# Altium schematic sheet REF_Diverse.SchDoc
size A4; SheetNumber: 7; SheetTotal: 8
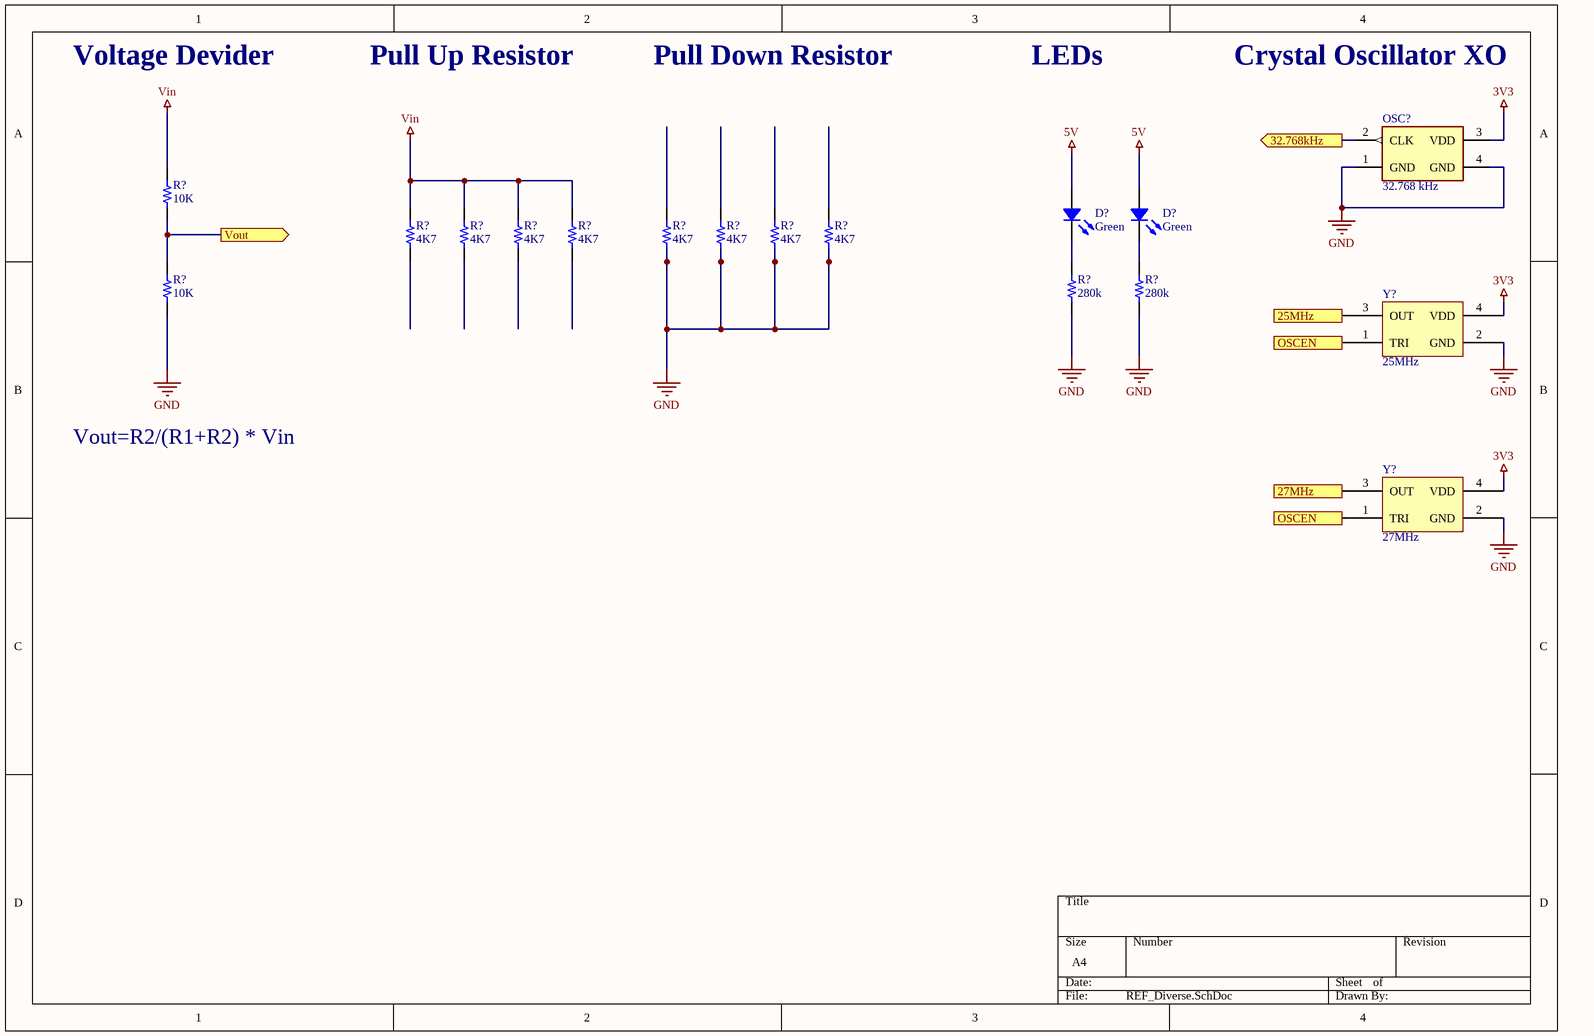
[diagram p0: REF_Diverse.SchDoc]

## Parts
(Parts that share a designator on the sheet are numbered #1, #2 ... from top to bottom, then left to right.)
D?#1  Green  [LED 0603/1608 GREEN]
D?#2  Green  [LED 0603/1608 GREEN]
OSC?  32.768 kHz  [SiT1532AIJ4DCC32768E - duplicate]
R?#1  10K  [RES 0603/1608]
R?#2  4K7  [RES 0603/1608]
R?#3  4K7  [RES 0603/1608]
R?#4  4K7  [RES 0603/1608]
R?#5  4K7  [RES 0603/1608]
R?#6  4K7  [RES 0603/1608]
R?#7  4K7  [RES 0603/1608]
R?#8  4K7  [RES 0603/1608]
R?#9  4K7  [RES 0603/1608]
R?#10  10K  [RES 0603/1608]
R?#11  280k  [RES 1206/3216]
R?#12  280k  [RES 1206/3216]
Y?#1  25MHz  [ABRACON ASD]
Y?#2  27MHz  [ABRACON ASD]

## Ports
25MHz (out), 27MHz (out), 32.768kHz (out), OSCEN (in), Vout (out)

## Nets
3V3: OSC?.3(VDD) Y?#1.4(VDD) Y?#2.4(VDD)
5V: D?#1.1 D?#2.1
GND: OSC?.1(GND) OSC?.4(GND) R?#6.1 R?#7.1 R?#8.1 R?#9.1 R?#10.1 R?#11.2 R?#12.2 Y?#1.2(GND) Y?#2.2(GND)
Vin: R?#1.2 R?#2.2 R?#3.2 R?#4.2 R?#5.2
25MHz: Y?#1.3(OUT) ; port 25MHz
27MHz: Y?#2.3(OUT) ; port 27MHz
32.768kHz: OSC?.2(CLK) ; port 32.768kHz
OSCEN: Y?#1.1(TRI) Y?#2.1(TRI) ; port OSCEN
Vout: R?#1.1 R?#10.2 ; port Vout
NetD?#1_2: D?#1.2 R?#11.1
NetD?#2_2: D?#2.2 R?#12.1

Not connected (* = marked no-connect by the designer): R?#2 1; R?#3 1; R?#4 1; R?#5 1; R?#6 2; R?#7 2; R?#8 2; R?#9 2

## Notes on the sheet
- Voltage Devider
- Pull Up Resistor
- Pull Down Resistor
- LEDs
- Crystal Oscillator XO
- Vout=R2/(R1+R2) * Vin

## Library data of the parts
D?#1 D?#2 = HSMQ-C191: LED GREEN DIFFUSED 0603 SMD; Manufacturer: Avago Technologies US Inc.; Type: Surface Mount; Millicandela: 145mcd; Voltage Forward: 3.4V; Current (Test): 20mA; Viewing Angle: 140; Value: Green; Part Number: HSMQ-C191; PartId: 7059; Supplier 1: Digi-Key; Supplier Part Number 1: 516-1807-2-ND; ComponentLink1Description: Datasheet; ComponentLink1URL: http://www.avagotech.com/docs/AV02-0977EN; ComponentLink2Description: Digi-Key Listing; ComponentLink2URL: http://www.digikey.ca/product-detail/en/HSMQ-C191/516-1807-2-ND/1012398; Price: 0.4769; Device Package: 0603 (1608 Metric); Colour: Green; Lens Transparency: Diffused
OSC? = SiT1532AI: Oscilator 32.768KHz, SiT1532AI-J4-DCC-32.768E
R?#1 R?#10 = 0603S8J0103: RES SMD 10K OHM 5% 1/8W 0603; Manufacturer: Uniohm; TemperatureRange: -55C ~ 155C; TemperatureCoefficient: 100ppm/C; PowerRating: 0.125W, 1/8W; Value: 10K; Part Number: 0603S8J0103; Tolerance: 5%; Price: 0.0089; Device Package: 1608 (0603 Metric)
R?#2-R?#9 = 0603S8J0472: RES SMD 4K7 OHM 5% 1/8W 0603; Manufacturer: Uniohm; TemperatureRange: -55C ~ 155C; TemperatureCoefficient: 100ppm/C; PowerRating: 0.125W, 1/8W; Value: 4K7; Part Number: 0603S8J0472; Tolerance: 5%; Price: 0.0089; Device Package: 1608 (0603 Metric)
R?#11 R?#12 = ERA-8AEB2803V: RES SMD 280K OHM 0.1% 1/4W 1206; Manufacturer: Panasonic Electronic Components; TemperatureRange: -55C ~ 155C; TemperatureCoefficient: 25ppm/C; PowerRating: 0.25W, 1/4W; Value: 280k; Part Number: ERA-8AEB2803V; PartId: 3611; Supplier 1: Digi-Key; Supplier Part Number 1: P280KBCTR-ND; ComponentLink1Description: Datasheet; ComponentLink1URL: http://industrial.panasonic.com/lecs/www-data/pdf/AOA0000/AOA0000CE26.pdf; ComponentLink2Description: Digi-Key listing; ComponentLink2URL: http://digikey.com/product-detail/en/ERA-8AEB2803V/P280KBCTR-ND/3070936; Tolerance: 0.1%; Price: 0.1954; Type: Thin Film; Device Package: 1206 (3216 Metric)
Y?#1 = ASD1-25.000MHZ-EC-T: OSC XO 25.000MHZ CMOS SMD; Manufacturer: Abracon LLC; Frequency Stability: 50ppm; Part Number: ASD1-25.000MHZ-EC-T; PartId: 8941; Supplier 1: Digi-Key; Supplier Part Number 1: 535-9593-2-ND; ComponentLink1Description: Datasheet; ComponentLink1URL: http://www.abracon.com/Oscillators/ASDseries.pdf; ComponentLink2Description: Digi-Key Listing; ComponentLink2URL: https://www.digikey.com/product-detail/en/ASD1-25.000MHZ-EC-T/535-9593-2-ND/1236910; Price: 1.74; Type: XO (Standard); Device Package: 4-SMD, No Lead (DFN, LCC); Series: ASD; Frequency: 25MHz
Y?#2 = ASD1-27.000MHZ-EC-T: OSC XO 27.000MHZ CMOS SMD; Manufacturer: Abracon LLC; Frequency Stability: 50ppm; Part Number: ASD1-27.000MHZ-EC-T; PartId: 8938; Supplier 1: Digi-Key; Supplier Part Number 1: 535-9594-2-ND; ComponentLink1Description: Datasheet; ComponentLink1URL: http://www.abracon.com/Oscillators/ASDseries.pdf; ComponentLink2Description: Digi-Key Listing; ComponentLink2URL: https://www.digikey.com/product-detail/en/ASD1-27.000MHZ-EC-T/535-9594-2-ND/1236911; Price: 1.74; Type: XO (Standard); Device Package: 4-SMD, No Lead (DFN, LCC); Series: ASD; Frequency: 27MHz